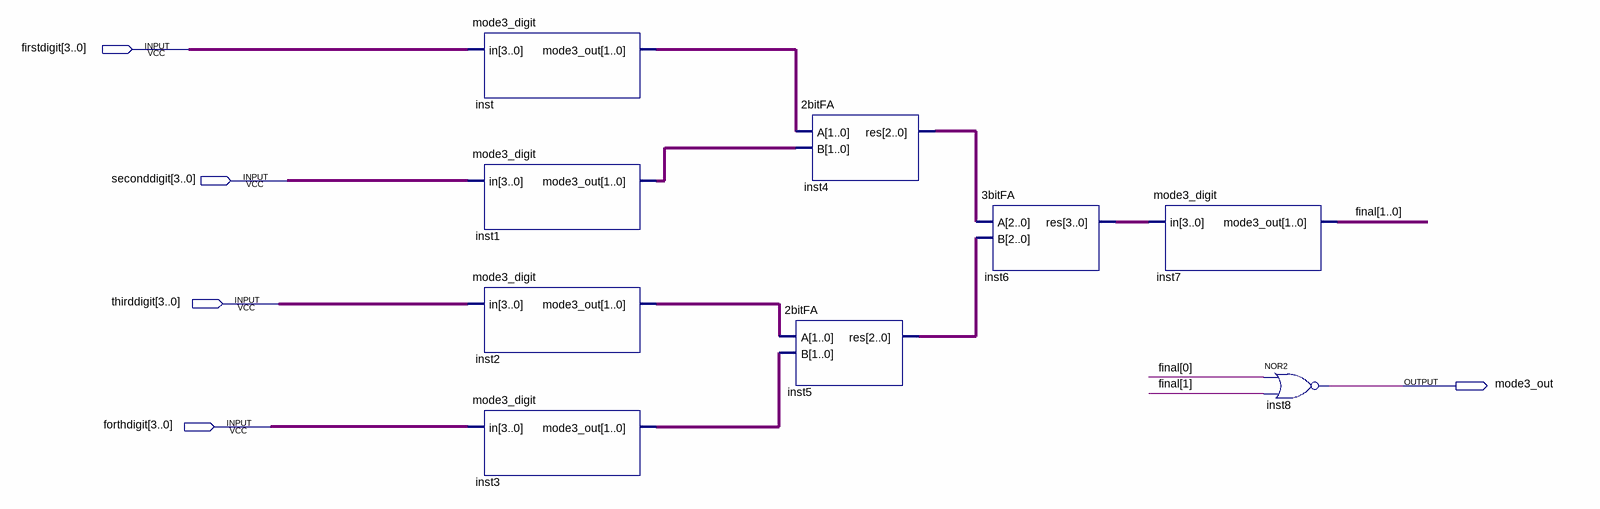
[diagram p0: schematic sheet]
// Quartus schematic mode3_module.bdf as structural Verilog: 9 symbols, 5 pins
module mode3_module (
  input  [3:0] firstdigit,
  input  [3:0] seconddigit,
  input  [3:0] thirddigit,
  input  [3:0] forthdigit,
  output mode3_out
);

  wire [1:0] \final , inst1_mode3_out, inst2_mode3_out, inst3_mode3_out, inst_mode3_out;
  wire [2:0] inst4_res, inst5_res;
  wire [3:0] inst6_res;

  mode3_digit inst (.in(firstdigit), .mode3_out(inst_mode3_out));
  mode3_digit inst1 (.in(seconddigit), .mode3_out(inst1_mode3_out));
  mode3_digit inst2 (.in(thirddigit), .mode3_out(inst2_mode3_out));
  mode3_digit inst3 (.in(forthdigit), .mode3_out(inst3_mode3_out));
  \2bitFA  inst5 (.A(inst2_mode3_out), .B(inst3_mode3_out), .res(inst5_res));
  \2bitFA  inst4 (.A(inst_mode3_out), .B(inst1_mode3_out), .res(inst4_res));
  \3bitFA  inst6 (.A(inst4_res), .B(inst5_res), .res(inst6_res));
  mode3_digit inst7 (.in(inst6_res), .mode3_out(\final ));
  nor inst8 (mode3_out, \final [0], \final [1]);
endmodule
